# Altium schematic sheet PLC.SchDoc
size C; SheetNumber: 2; SheetTotal: 8
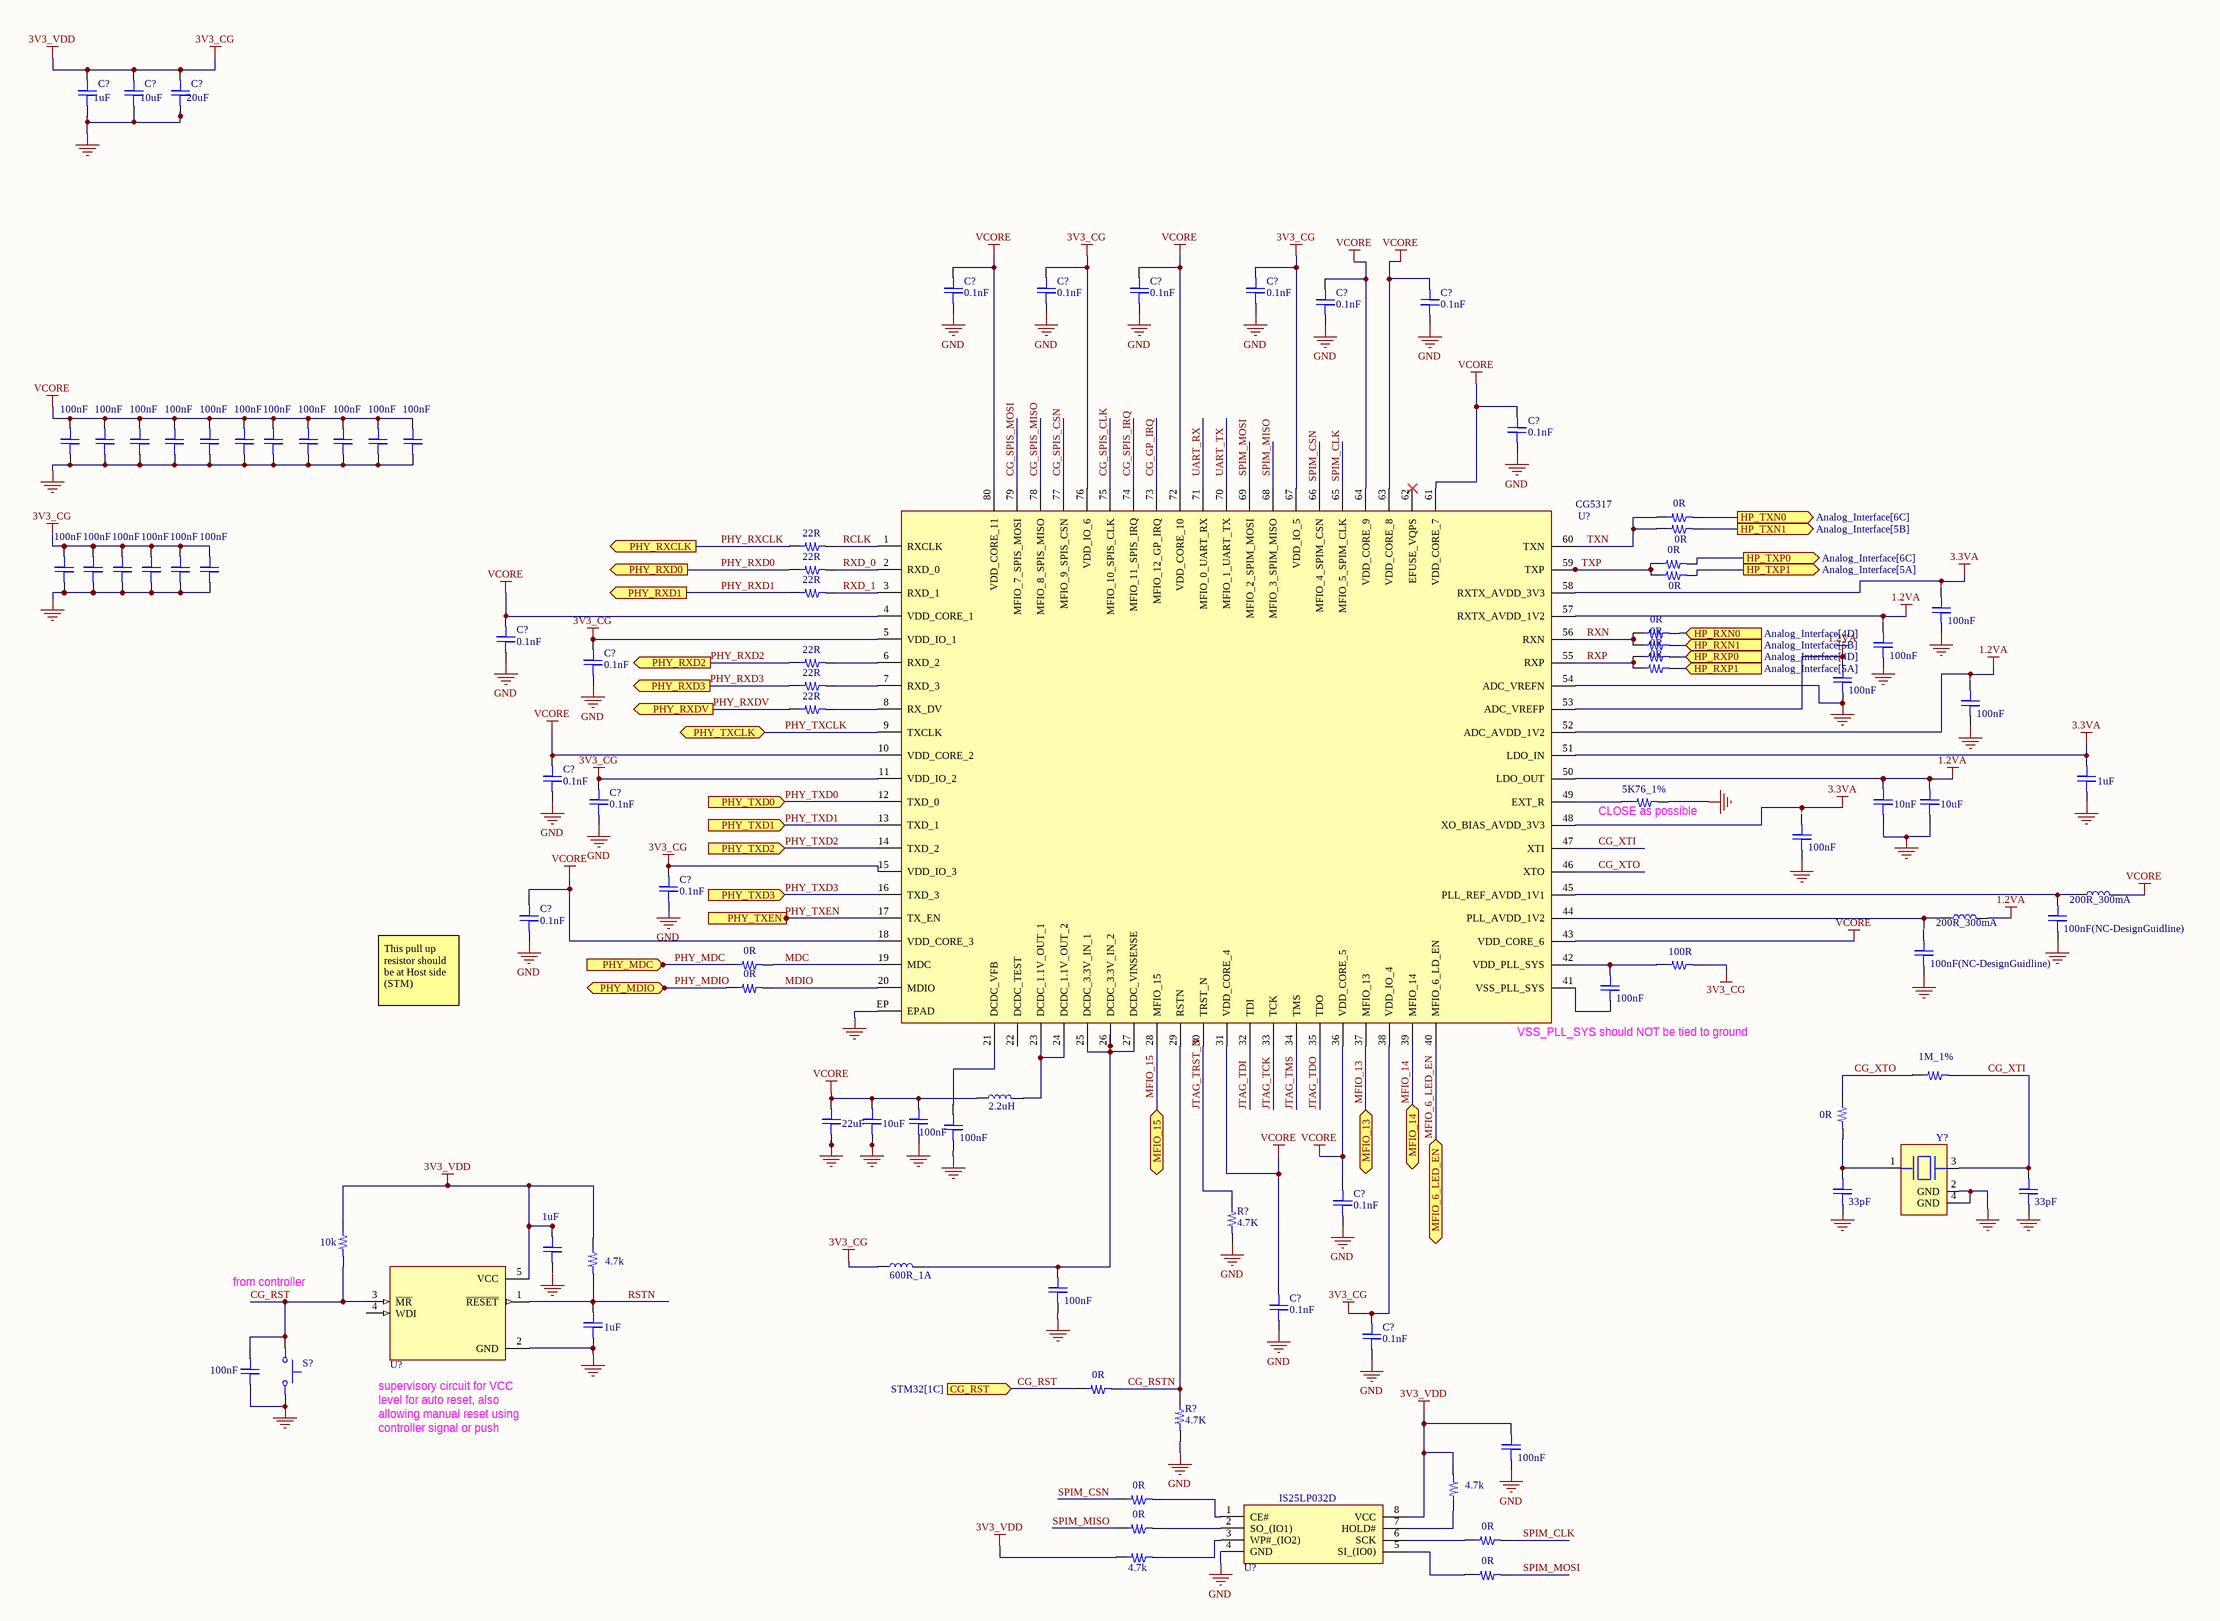
[diagram p0: PLC.SchDoc]

## Parts
(Parts that share a designator on the sheet are numbered #1, #2 ... from top to bottom, then left to right.)
C?#1  value 1uF  [C0402]
C?#2  value 10uF  [C0402]
C?#3  value 20uF  [C0402]
C?#4  value 0.1nF  [C0402]  (hidden comment: Capacitor)
C?#5  value 0.1nF  [C0402]  (hidden comment: Capacitor)
C?#6  value 0.1nF  [C0402]  (hidden comment: Capacitor)
C?#7  value 0.1nF  [C0402]  (hidden comment: Capacitor)
C?#8  value 0.1nF  [C0402]  (hidden comment: Capacitor)
C?#9  value 0.1nF  [C0402]  (hidden comment: Capacitor)
C?#10  value 0.1nF  [C0402]  (hidden comment: Capacitor)
C?#11  value 100nF  [C0402]  (hidden comment: Capacitor)
C?#12  value 100nF  [C0402]  (hidden comment: Capacitor)
C?#13  value 100nF  [C0402]  (hidden comment: Capacitor)
C?#14  value 100nF  [C0402]  (hidden comment: Capacitor)
C?#15  value 100nF  [C0402]  (hidden comment: Capacitor)
C?#16  value 100nF  [C0402]  (hidden comment: Capacitor)
C?#17  value 100nF  [C0402]  (hidden comment: Capacitor)
C?#18  value 100nF  [C0402]  (hidden comment: Capacitor)
C?#19  value 100nF  [C0402]  (hidden comment: Capacitor)
C?#20  value 100nF  [C0402]  (hidden comment: Capacitor)
C?#21  value 100nF  [C0402]  (hidden comment: Capacitor)
C?#22  value 100nF  [C0402]  (hidden comment: Capacitor)
C?#23  value 100nF  [C0402]  (hidden comment: Capacitor)
C?#24  value 100nF  [C0402]  (hidden comment: Capacitor)
C?#25  value 100nF  [C0402]  (hidden comment: Capacitor)
C?#26  value 100nF  [C0402]  (hidden comment: Capacitor)
C?#27  value 100nF  [C0402]  (hidden comment: Capacitor)
C?#28  value 100nF  [C0402]  (hidden comment: Capacitor)
C?#29  value 100nF  [C0402]  (hidden comment: Capacitor)
C?#30  value 0.1nF  [C0402]  (hidden comment: Capacitor)
C?#31  value 100nF  [C0402]  (hidden comment: Capacitor)
C?#32  value 0.1nF  [C0402]  (hidden comment: Capacitor)
C?#33  value 100nF  [C0402]  (hidden comment: Capacitor)
C?#34  value 1uF  [C0402]  (hidden comment: Capacitor)
C?#35  value 0.1nF  [C0402]  (hidden comment: Capacitor)
C?#36  value 10nF  [C0402]  (hidden comment: Capacitor)
C?#37  value 10uF  [C0402]  (hidden comment: Capacitor)
C?#38  value 0.1nF  [C0402]  (hidden comment: Capacitor)
C?#39  value 100nF  [C0402]  (hidden comment: Capacitor)
C?#40  value 0.1nF  [C0402]  (hidden comment: Capacitor)
C?#41  value 100nF(NC-DesignGuidline)  [C0402]  (hidden comment: Capacitor)
C?#42  value 0.1nF  [C0402]  (hidden comment: Capacitor)
C?#43  value 100nF(NC-DesignGuidline)  [C0402]  (hidden comment: Capacitor)
C?#44  value 100nF  [C0402]  (hidden comment: Capacitor)
C?#45  value 22uF  [C0402]  (hidden comment: Capacitor)
C?#46  value 10uF  [C0402]  (hidden comment: Capacitor)
C?#47  value 100nF  [C0402]  (hidden comment: Capacitor)
C?#48  value 100nF  [C0402]  (hidden comment: Capacitor)
C?#49  value 33pF  [C0402]  (hidden comment: Capacitor)
C?#50  value 33pF  [C0402]  (hidden comment: Capacitor)
C?#51  value 0.1nF  [C0402]  (hidden comment: Capacitor)
C?#52  value 1uF  [C0402]  (hidden comment: Capacitor)
C?#53  value 0.1nF  [C0402]  (hidden comment: Capacitor)
C?#54  value 100nF  [C0402]  (hidden comment: Capacitor)
C?#55  value 0.1nF  [C0402]  (hidden comment: Capacitor)
C?#56  value 1uF  [C0402]  (hidden comment: Capacitor)
C?#57  value 100nF  [C0402]  (hidden comment: Capacitor)
C?#58  value 100nF  [C0402]  (hidden comment: Capacitor)
L?#1  value 200R_300mA  [L_0805]  (hidden comment: Inductor_SMT)
L?#2  value 200R_300mA  [L_0805]  (hidden comment: Inductor_SMT)
L?#3  value 2.2uH  [L_0805]  (hidden comment: Inductor_SMT)
L?#4  value 600R_1A  [L_0805]  (hidden comment: Inductor_SMT)
R?#1  value 0R  [R0402]  (hidden comment: Resistor)
R?#2  value 0R  [R0402]  (hidden comment: Resistor)
R?#3  value 22R  [R0402]  (hidden comment: Resistor)
R?#4  value 0R  [R0402]  (hidden comment: Resistor)
R?#5  value 22R  [R0402]  (hidden comment: Resistor)
R?#6  value 0R  [R0402]  (hidden comment: Resistor)
R?#7  value 22R  [R0402]  (hidden comment: Resistor)
R?#8  value 0R  [R0402]  (hidden comment: Resistor)
R?#9  value 0R  [R0402]  (hidden comment: Resistor)
R?#10  value 0R  [R0402]  (hidden comment: Resistor)
R?#11  value 22R  [R0402]  (hidden comment: Resistor)
R?#12  value 0R  [R0402]  (hidden comment: Resistor)
R?#13  value 22R  [R0402]  (hidden comment: Resistor)
R?#14  value 22R  [R0402]  (hidden comment: Resistor)
R?#15  value 5K76_1%  [R0402]  (hidden comment: Resistor)
R?#16  value 0R  [R0402]  (hidden comment: Resistor)
R?#17  value 100R  [R0402]  (hidden comment: Resistor)
R?#18  value 0R  [R0402]  (hidden comment: Resistor)
R?#19  value 1M_1%  [R0402]  (hidden comment: Resistor)
R?#20  value 0R  [R0402]  (hidden comment: Resistor)
R?#21  value 4.7K  [R0402]  (hidden comment: Resistor)
R?#22  value 10k  [R0402]  (hidden comment: Resistor)
R?#23  value 4.7k  [R0402]  (hidden comment: Resistor)
R?#24  value 0R  [R0402]  (hidden comment: Resistor)
R?#25  value 4.7K  [R0402]  (hidden comment: Resistor)
R?#26  value 4.7k  [R0402]  (hidden comment: Resistor)
R?#27  value 0R  [R0402]  (hidden comment: Resistor)
R?#28  value 0R  [R0402]  (hidden comment: Resistor)
R?#29  value 0R  [R0402]  (hidden comment: Resistor)
R?#30  value 4.7k  [R0402]  (hidden comment: Resistor)
R?#31  value 0R  [R0402]  (hidden comment: Resistor)
S?  Push Button 4 pin  [Push_Button(6x6mm)]  (value not drawn)
U?#1  value CG5317  [EP-LQFP80]  (hidden comment: HomePlug Green PHY Transceiver)
U?#2  Supervisory Circuits  [SOT-23-5]  (value not drawn)
U?#3  Flash Memory  [SOIC-8]  (value not drawn)
Y?  Crystal  [FL2500316Z]  (value not drawn)

## Ports
CG_RST (in, see STM32[1C]), HP_RXN0 (in, see Analog_Interface[4D]), HP_RXN1 (in, see Analog_Interface[5B]), HP_RXP0 (in, see Analog_Interface[4D]), HP_RXP1 (in, see Analog_Interface[5A]), HP_TXN0 (out, see Analog_Interface[6C]), HP_TXN1 (out, see Analog_Interface[5B]), HP_TXP0 (out, see Analog_Interface[6C]), HP_TXP1 (out, see Analog_Interface[5A]), MFIO_6_LED_EN (bidir), MFIO_13 (bidir), MFIO_14 (bidir), MFIO_15 (bidir), PHY_MDC (in), PHY_MDIO (bidir), PHY_RXCLK (out), PHY_RXD0 (out), PHY_RXD1 (out), PHY_RXD2 (out), PHY_RXD3 (out), PHY_RXDV (out), PHY_TXCLK (bidir), PHY_TXD0 (in), PHY_TXD1 (in), PHY_TXD2 (in), PHY_TXD3 (in), PHY_TXEN (in)

## Nets
1.2VA: C?#31.1 C?#36.1 C?#37.1 L?#2.2 U?#1.50(LDO_OUT) U?#1.52(ADC_AVDD_1V2) U?#1.53(ADC_VREFP) U?#1.57(RXTX_AVDD_1V2)
3.3VA: C?#34.1 U?#1.48(XO_BIAS_AVDD_3V3) U?#1.51(LDO_IN) U?#1.58(RXTX_AVDD_3V3)
3V3_CG: C?#1.1 C?#2.1 C?#3.1 C?#5.1 C?#7.1 C?#23.1 C?#24.1 C?#25.1 C?#26.1 C?#27.1 C?#28.1 C?#32.1 C?#38.1 C?#40.1 C?#52.1 C?#55.1 C?#58.1 L?#4.1 R?#17.1 R?#22.1 R?#23.1 R?#26.1 R?#30.1 U?#1.5(VDD_IO_1) U?#1.11(VDD_IO_2) U?#1.15(VDD_IO_3) U?#1.38(VDD_IO_4) U?#1.67(VDD_IO_5) U?#1.76(VDD_IO_6) U?#2.5(VCC) U?#3.8(VCC)  [also labelled 3V3_VDD]
GND: C?#1.1 C?#2.1 C?#3.1 C?#4.1 C?#5.1 C?#6.1 C?#7.1 C?#8.1 C?#9.1 C?#10.1 C?#11.1 C?#12.1 C?#13.1 C?#14.1 C?#15.1 C?#16.1 C?#17.1 C?#18.1 C?#19.1 C?#20.1 C?#21.1 C?#22.1 C?#23.1 C?#24.1 C?#25.1 C?#26.1 C?#27.1 C?#28.1 C?#29.1 C?#30.1 C?#31.1 C?#32.1 C?#33.1 C?#34.1 C?#35.1 C?#36.1 C?#37.1 C?#38.1 C?#39.1 C?#40.1 C?#41.1 C?#42.1 C?#43.1 C?#45.1 C?#46.1 C?#47.1 C?#48.1 C?#51.1 C?#53.1 C?#54.1 C?#55.1 C?#56.1 C?#57.1 C?#58.1 R?#15.1 R?#21.1 R?#25.1 S?.3 S?.4 U?#1.54(ADC_VREFN) U?#1.EP(EPAD) U?#2.2(GND) U?#3.4(GND) Y?.2(GND) Y?.4(GND)
VCORE: C?#4.1 C?#6.1 C?#8.1 C?#9.1 C?#10.1 C?#11.1 C?#12.1 C?#13.1 C?#14.1 C?#15.1 C?#16.1 C?#17.1 C?#18.1 C?#19.1 C?#20.1 C?#21.1 C?#30.1 C?#35.1 C?#42.1 C?#45.1 C?#46.1 C?#47.1 C?#51.1 C?#53.1 L?#1.2 L?#3.1 U?#1.4(VDD_CORE_1) U?#1.10(VDD_CORE_2) U?#1.18(VDD_CORE_3) U?#1.31(VDD_CORE_4) U?#1.36(VDD_CORE_5) U?#1.43(VDD_CORE_6) U?#1.61(VDD_CORE_7) U?#1.63(VDD_CORE_8) U?#1.64(VDD_CORE_9) U?#1.72(VDD_CORE_10) U?#1.80(VDD_CORE_11)
CG_GP_IRQ: U?#1.73(MFIO_12_GP_IRQ)
CG_RST: C?#57.1 R?#22.1 R?#24.1 S?.1 S?.2 U?#2.3(~{MR}) ; port CG_RST
CG_RSTN: R?#24.1 R?#25.1 U?#1.29(RSTN)
CG_SPIS_CLK: U?#1.75(MFIO_10_SPIS_CLK)
CG_SPIS_CSN: U?#1.77(MFIO_9_SPIS_CSN)
CG_SPIS_IRQ: U?#1.74(MFIO_11_SPIS_IRQ)
CG_SPIS_MISO: U?#1.78(MFIO_8_SPIS_MISO)
CG_SPIS_MOSI: U?#1.79(MFIO_7_SPIS_MOSI)
CG_XTI: C?#50.1 R?#19.1 U?#1.47(XTI) Y?.3
CG_XTO: R?#19.1 R?#20.1 U?#1.46(XTO)
HP_RXN0: R?#8.1 ; port HP_RXN0
HP_RXN1: R?#9.1 ; port HP_RXN1
HP_RXP0: R?#10.1 ; port HP_RXP0
HP_RXP1: R?#12.1 ; port HP_RXP1
HP_TXN0: R?#1.1 ; port HP_TXN0
HP_TXN1: R?#2.1 ; port HP_TXN1
HP_TXP0: R?#4.1 ; port HP_TXP0
HP_TXP1: R?#6.1 ; port HP_TXP1
JTAG_TCK: U?#1.33(TCK)
JTAG_TDI: U?#1.32(TDI)
JTAG_TDO: U?#1.35(TDO)
JTAG_TMS: U?#1.34(TMS)
JTAG_TRST_N: R?#21.1 U?#1.30(TRST_N)
MDC: R?#16.1 U?#1.19(MDC)
MDIO: R?#18.1 U?#1.20(MDIO)
MFIO_6_LED_EN: U?#1.40(MFIO_6_LD_EN) ; port MFIO_6_LED_EN
MFIO_13: U?#1.37(MFIO_13) ; port MFIO_13
MFIO_14: U?#1.39(MFIO_14) ; port MFIO_14
MFIO_15: U?#1.28(MFIO_15) ; port MFIO_15
PHY_MDC: R?#16.1 ; port PHY_MDC
PHY_MDIO: R?#18.1 ; port PHY_MDIO
PHY_RXCLK: R?#3.1 ; port PHY_RXCLK
PHY_RXD0: R?#5.1 ; port PHY_RXD0
PHY_RXD1: R?#7.1 ; port PHY_RXD1
PHY_RXD2: R?#11.1 ; port PHY_RXD2
PHY_RXD3: R?#13.1 ; port PHY_RXD3
PHY_RXDV: R?#14.1 ; port PHY_RXDV
PHY_TXCLK: U?#1.9(TXCLK) ; port PHY_TXCLK
PHY_TXD0: U?#1.12(TXD_0) ; port PHY_TXD0
PHY_TXD1: U?#1.13(TXD_1) ; port PHY_TXD1
PHY_TXD2: U?#1.14(TXD_2) ; port PHY_TXD2
PHY_TXD3: U?#1.16(TXD_3) ; port PHY_TXD3
PHY_TXEN: U?#1.17(TX_EN) ; port PHY_TXEN
RCLK: R?#3.1 U?#1.1(RXCLK)
RSTN: C?#56.1 R?#23.1 U?#2.1(~{RESET})
RXD_0: R?#5.1 U?#1.2(RXD_0)
RXD_1: R?#7.1 U?#1.3(RXD_1)
RXN: R?#8.1 R?#9.1 U?#1.56(RXN)
RXP: R?#10.1 R?#12.1 U?#1.55(RXP)
SPIM_CLK: R?#29.1 U?#1.65(MFIO_5_SPIM_CLK)
SPIM_CSN: R?#27.1 U?#1.66(MFIO_4_SPIM_CSN)
SPIM_MISO: R?#28.1 U?#1.68(MFIO_3_SPIM_MISO)
SPIM_MOSI: R?#31.1 U?#1.69(MFIO_2_SPIM_MOSI)
TXN: R?#1.1 R?#2.1 U?#1.60(TXN)
TXP: R?#4.1 R?#6.1 U?#1.59(TXP)
UART_RX: U?#1.71(MFIO_0_UART_RX)
UART_TX: U?#1.70(MFIO_1_UART_TX)
NetC?#41_1: C?#41.1 L?#1.1 U?#1.45(PLL_REF_AVDD_1V1)
NetC?#44_1: C?#44.1 R?#17.1 U?#1.42(VDD_PLL_SYS)
NetC?#44_1: C?#44.1 U?#1.41(VSS_PLL_SYS)  [a separate net that carries the same name]
NetC?#48_1: C?#48.1 U?#1.21(DCDC_VFB)
NetC?#49_1: C?#49.1 R?#20.1 Y?.1
NetC?#54_1: C?#54.1 L?#4.2 U?#1.25(DCDC_3.3V_IN_1) U?#1.26(DCDC_3.3V_IN_2) U?#1.27(DCDC_VINSENSE)
NetL?#2_1: L?#2.1 U?#1.44(PLL_AVDD_1V2)
NetL?#3_2: L?#3.2 U?#1.23(DCDC_1.1V_OUT_1) U?#1.24(DCDC_1.1V_OUT_2)
NetR?#11_1: R?#11.1 U?#1.6(RXD_2)
NetR?#13_1: R?#13.1 U?#1.7(RXD_3)
NetR?#14_1: R?#14.1 U?#1.8(RX_DV)
NetR?#15_1: R?#15.1 U?#1.49(EXT_R)
NetR?#26_1: R?#26.1 U?#3.7(HOLD#)
NetR?#27_1: R?#27.1 U?#3.1(CE#)
NetR?#28_1: R?#28.1 U?#3.2(SO_(IO1))
NetR?#29_1: R?#29.1 U?#3.6(SCK)
NetR?#30_1: R?#30.1 U?#3.3(WP#_(IO2))
NetR?#31_1: R?#31.1 U?#3.5(SI_(IO0))

Not connected (* = marked no-connect by the designer): U?#1 22(DCDC_TEST) 62(EFUSE_VQPS)*; U?#2 4(WDI)

## Notes on the sheet
- (near R?#15) CLOSE as possible
- This pull up resistor should be at Host side (STM)
- (near U?#1) VSS_PLL_SYS should NOT be tied to ground
- (near R?#22) from controller
- (near U?#2) supervisory circuit for VCC level for auto reset, also allowing manual reset using controller signal or push buttonText
- Labels drawn without touching a wire or pin: GND

## Library data of the parts
C?#1-C?#3 C?#11-C?#29 C?#31 C?#33 C?#34 C?#36 C?#37 C?#39 C?#41 C?#43-C?#50 C?#52 C?#54 C?#56-C?#58 = CAP_SMT: ComponentLink1Description: New link
C?#4-C?#10 C?#30 C?#32 C?#35 C?#38 C?#40 C?#42 C?#51 C?#53 C?#55 = C_0.1uf: 50V 100nF X7R ±10% 0402 Multilayer Ceramic Capacitors MLCC - SMD/SMT ROHS; Mfr: YAGEO; Mfr_prt_no: CC0402KRX7R9BB104; pkg: 0402; ComponentLink1Description: New link; ComponentLink1URL: https://www.lcsc.com/product-detail/Multilayer-Ceramic-Capacitors-MLCC-SMD-SMT_YAGEO-CC0402KRX7R9BB104_C131394.html; supplier: LCSC; supplier_prt_no: C131394
R?#1-R?#20 R?#22-R?#24 R?#26-R?#31 = RES_SMT: ComponentLink1Description: New link; ComponentLink1URL: *
R?#21 R?#25 = R_4.7K: 62.5mW Thick Film Resistors 50V ±100ppm/℃ ±5% 4.7kΩ 0402 Chip Resistor - Surface Mount ROHS; Mfr: YAGEO; Mfr_prt_no: RC0402JR-074K7L; pkg: 0402; ComponentLink1Description: New link; ComponentLink1URL: *; supplier: LCSC; supplier_prt_no: C105870
S? = Push_Button: Push Button SMD(6x6mm) 4 pin; ComponentLink1Description: New link
U?#1 = CG5317: HomePlug Green PHY Transceiver,EP-LQFP80; ComponentLink1Description: New link
U?#2 = MAX823: Supervisory Circuits 5-Pin Microprocessor Supervisory Circuit; ComponentLink1Description: New link
U?#3 = IS25LP032D: FLASH - NOR Memory IC 32Mb (4M x 8) SPI - Quad I/O, QPI, DTR 133 MHz 8-SOIC; ComponentLink1Description: New link; Mfr_prt_no: IS25LP032D
Y? = FL2500316Z: 25 MHz ±20ppm Crystal 20pF 30 Ohms 4-SMD, No Lead; ComponentLink1Description: New link
L?#1-L?#4 = Inductor_SMT: ComponentLink1Description: New link